# Altium schematic sheet CW340_SAM3X_USB.SchDoc: MCU USB
size Letter; Organization: NewAE Technology Inc.; Address1: 1083 Queen St., Suite 196; Address2: Halifax; Address3: NS; Address4: Canada B3H 0B2; DocumentNumber: .; Revision: .; SheetNumber: 7; SheetTotal: 31; SheetApproved: NO
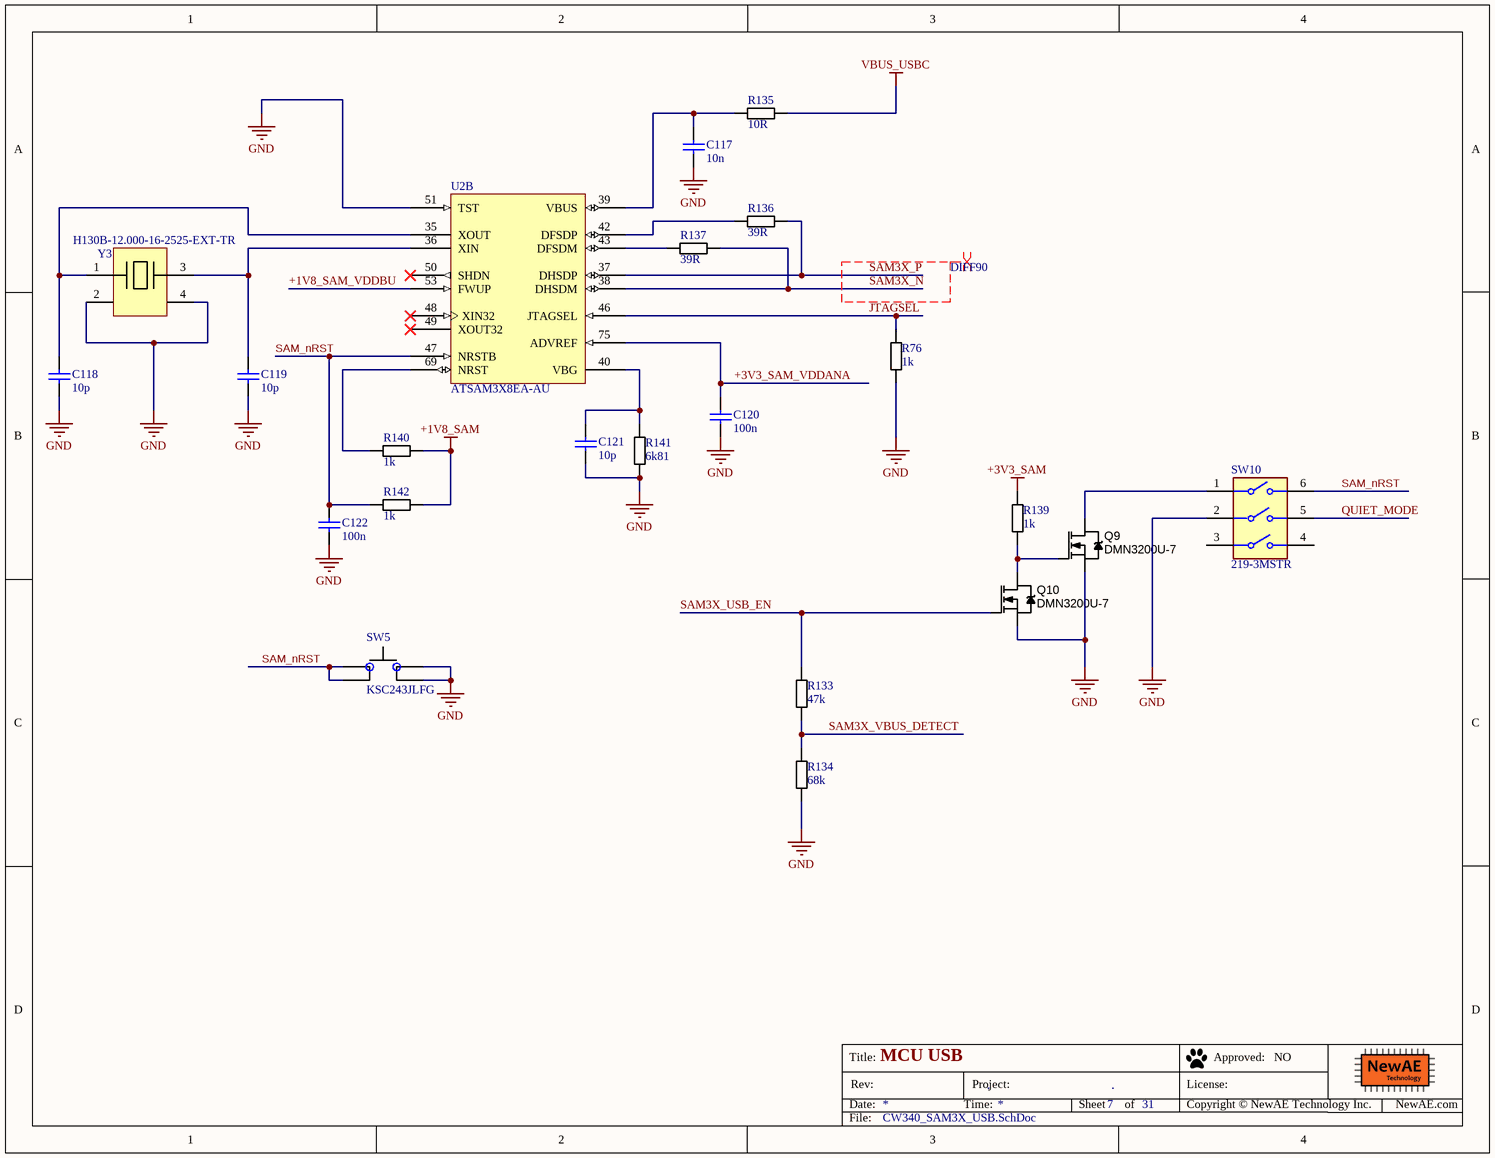
[diagram p0: CW340_SAM3X_USB.SchDoc]

## Parts
C117  10n  [CAPC0603_M]
C118  10p  [RESC1608X55N]
C119  10p  [RESC1608X55N]
C120  100n  [CAPC0402_M]
C121  10p  [CAPC0603_M]
C122  100n  [CAPC0402_M]
Q9  DMN3200U-7  [SOT95P245X110-3M]
Q10  DMN3200U-7  [SOT95P245X110-3M]
R76  1k  [RESC1005X40N]
R133  47k  [RESC1608X55N]
R134  68k  [RESC1608X55N]
R135  10R  [RESC1608X55N]
R136  39R  [RESC1608X55N]
R137  39R  [RESC1608X55N]
R139  1k  [RESC1005X40N]
R140  1k  [RESC1005X40N]
R141  6k81  [RESC1608X55N]
R142  1k  [RESC1005X40N]
SW5  KSC243JLFG  [CK_KSC2J]
SW10  219-3MSTR  [FP-219-3MSTR-MFG]
U2  ATSAM3X8EA-AU  [LQFP144_L]  (part B of 3)
Y3  H130B-12.000-16-2525-EXT-TR  [5x3.2MM XTAL]

## Nets
+1V8_SAM: R140.2 R142.1
+3V3_SAM: R139.2
GND: C117.2 C118.2 C119.2 C120.2 C121.2 C122.2 Q9.2(S) Q10.2(S) R76.2 R134.2 R141.2 SW5.2(IN) SW5.3(IN) SW10.2 U2.51(TST) Y3.2 Y3.4
VBUS_USBC: R135.2
+1V8_SAM_VDDBU: U2.53(FWUP)
+3V3_SAM_VDDANA: C120.1 U2.75(ADVREF)
JTAGSEL: R76.1 U2.46(JTAGSEL)
QUIET_MODE: SW10.5
SAM3X_N: R137.2 U2.38(DHSDM)
SAM3X_P: R136.2 U2.37(DHSDP)
SAM3X_USB_EN: Q10.1(G) R133.1
SAM3X_VBUS_DETECT: R133.2 R134.1
SAM_nRST: C122.1 R142.2 SW5.1(IN) SW5.4(IN) SW10.6 U2.47(NRSTB)
NetC117_1: C117.1 R135.1 U2.39(VBUS)
NetC118_1: C118.1 U2.35(XOUT) Y3.1
NetC119_1: C119.1 U2.36(XIN) Y3.3
NetC121_1: C121.1 R141.1 U2.40(VBG)
NetQ9_1: Q9.1(G) Q10.3(D) R139.1
NetQ9_3: Q9.3(D) SW10.1
NetR136_1: R136.1 U2.42(DFSDP)
NetR137_1: R137.1 U2.43(DFSDM)
NetR140_1: R140.1 U2.69(NRST)

Not connected (* = marked no-connect by the designer): SW10 3 4; U2 48(XIN32)* 49(XOUT32)* 50(SHDN)*

## Layout directives
differential pair; differential pair class DIFF90: SAM3X_N, SAM3X_P

## Notes on the sheet
- Title:
- Date:
- Rev:
- Time:
- Project:
- Sheet
- of
- License:
- Copyright © NewAE Technology Inc.
- Approved:
- NewAE.com
- File:

## Library data of the parts
C117 = CCHIP-10n-0603: 10n, 0603; Component Group: Capacitor; Case-EIA: 0603; Case-Metric: 1608; Part Number: CCHIP-10n-0603; Footprint: 0603; Pin Count: 2; Supplier 1: Digi-Key; Supplier Part Number 1: 399-1091-1-ND; Value: 10n; Mounting Technology: SMT; Component Kind: Standard; Component Type: Standard
C118 C119 = CCHIP-10P-0603-50V: CAP CER 10PF 50V C0G/NP0 0603; Manufacture 1: Murata Electronics North America; Manufacture Part Number 1: GRM1885C1H100JA01D; Component Group: Capacitor; Case-EIA: 0603; Case-Metric: 1608; Tolerance: ±5%; PP Material Stack: 0; Part Number: CCHIP-10P-0603-50V; Footprint: 0603; Pin Count: 2; Supplier 1: Digi-Key; Supplier Part Number 1: 490-1403-1-ND; Value: 10p; Rated Voltage: 50V; Mounting Technology: SMT; Component Kind: Standard; Component Type: Standard; PP Rotation: 0
C120 C122 = CCHIP-100n-0402: 100n, 0402; Manufacture Part Number 1: CGA2B3X7R1V104K050BB; Component Group: Capacitor; Case-EIA: 0402; Part Number: CCHIP-100n-0402; Footprint: 0402; Pin Count: 2; Value: 100n; Mounting Technology: SMT; Component Kind: Standard; Component Type: Standard; Supplier 1: Digi-Key; Supplier Part Number 1: 445-6901-1-ND
C121 = CCHIP-10p-0603: 10p, 0603; Component Group: Capacitor; Case-EIA: 0603; Case-Metric: 1608; Part Number: CCHIP-10p-0603; Footprint: 0603; Pin Count: 2; Supplier 1: Digi-Key; Supplier Part Number 1: 399-1049-1-ND; Value: 10p; Mounting Technology: SMT; Component Kind: Standard; Component Type: Standard
Q9 Q10 = DMN3200U-7: MOSFET N-CH 30V 2.2A SOT23-3; Manufacture 1: Diodes Inc.; Rated Power: 3A; PP Material Stack: 0; Part Number: DMN3200U-7; Component Group: MOSFET; Footprint: SOT23; Manufacture Part Number 1: DMN3200U-7; Pin Count: 3; Supplier 1: Digi-Key; Supplier Part Number 1: DMN3200U-7DICT-ND; Rated Voltage: 30V; Mounting Technology: SMT; RoHS: Yes; Component Kind: Standard; Component Type: Standard; PP Rotation: 0
R76 R139 R140 R142 = RCHIP-1K-0402: 1k res, 0402, 1%, 1/16W; Manufacture 1: Yageo; Manufacture Part Number 1: RC0402FR-071KL; Component Group: Resistor; Case-EIA: 0402; Case-Metric: 1005; Rated Power: 0.063W; Rated Voltage: 75VDC; Part Number: RCHIP-1K-0402; Footprint: 0402; Pin Count: 2; Supplier 1: Digi-Key; Supplier Part Number 1: 311-1.00KLRCT-ND; Value: 1k; Tolerance: 1%; Mounting Technology: SMT; Temperature Range: -55C to 155C; Component Kind: Standard; Component Type: Standard
R133 = RCHIP-47K-0603: 47k res, 0603, 1%, 1/10W; Manufacture 1: Yageo; Manufacture Part Number 1: RC0603FR-0747KL; Component Group: Resistor; Case-EIA: 0603; Case-Metric: 1608; Rated Power: 0.1W; Rated Voltage: 75VDC; Part Number: RCHIP-47K-0603; Footprint: 0603; Pin Count: 2; Supplier 1: Digi-Key; Supplier Part Number 1: 311-47.0KHRCT-ND; Value: 47k; Tolerance: 1%; Mounting Technology: SMT; Temperature Range: -55C to 155C; Component Kind: Standard; Component Type: Standard
R134 = RCHIP-68K-0603: 68k res, 0603, 1%, 1/10W; Manufacture 1: Yageo; Manufacture Part Number 1: RC0603FR-0768KL; Component Group: Resistor; Case-EIA: 0603; Case-Metric: 1608; Rated Power: 0.1W; Rated Voltage: 75VDC; Part Number: RCHIP-68K-0603; Footprint: 0603; Pin Count: 2; Supplier 1: Digi-Key; Supplier Part Number 1: 311-68.0KHRCT-ND; Value: 68k; Tolerance: 1%; Mounting Technology: SMT; Temperature Range: -55C to 155C; Component Kind: Standard; Component Type: Standard
R135 = RCHIP-10R-0603: 10R res, 0603, 1%, 1/10W; Manufacture 1: Yageo; Manufacture Part Number 1: RC0603FR-0710RL; Component Group: Resistor; Case-EIA: 0603; Case-Metric: 1608; Rated Power: 0.1W; Rated Voltage: 75VDC; Part Number: RCHIP-10R-0603; Footprint: 0603; Pin Count: 2; Supplier 1: Digi-Key; Supplier Part Number 1: 311-10.0HRCT-ND; Value: 10R; Tolerance: 1%; Mounting Technology: SMT; Temperature Range: -55C to 155C; Component Kind: Standard; Component Type: Standard
R136 R137 = RCHIP-39R-0603: 39R res, 0603, 1%, 1/10W; Manufacture 1: Yageo; Manufacture Part Number 1: RC0603FR-0739RL; Component Group: Resistor; Case-EIA: 0603; Case-Metric: 1608; Rated Power: 0.1W; Rated Voltage: 75VDC; Part Number: RCHIP-39R-0603; Footprint: 0603; Pin Count: 2; Supplier 1: Digi-Key; Supplier Part Number 1: 311-39.0HRCT-ND; Value: 39R; Tolerance: 1%; Mounting Technology: SMT; Temperature Range: -55C to 155C; Component Kind: Standard; Component Type: Standard
R141 = RCHIP-6K81-0603: 6k81 res, 0603, 1%, 1/10W; Manufacture 1: Yageo; Manufacture Part Number 1: RC0603FR-076K81L; Component Group: Resistor; Case-EIA: 0603; Case-Metric: 1608; Rated Power: 0.1W; Rated Voltage: 75VDC; Part Number: RCHIP-6K81-0603; Footprint: 0603; Pin Count: 2; Supplier 1: Digi-Key; Supplier Part Number 1: 311-6.81KHRCT-ND; Value: 6k81; Tolerance: 1%; Mounting Technology: SMT; Temperature Range: -55C to 155C; Component Kind: Standard; Component Type: Standard
SW5 = TACTSW-KSC243J: SWITCH TACTILE SPST-NO 0.01A 32V; Manufacture 1: C&K; Part Number: TACTSW-KSC243J; Component Group: Switch; Manufacture Part Number 1: KSC243JLFG; Pin Count: 4; Supplier 1: Digi-Key; Supplier Part Number 1: 401-1764-1-ND; Mounting Technology: SMT; RoHS: Yes; Component Kind: Standard; Component Type: Standard
SW10 = CMP-07018-000004-1: SWITCH SLIDE DIP SPST 100MA 20V; Washable: Yes; Mechanical Life: 2000Cycles; Number of Positions: 3; Pitch: 0.1inch; Actuator Type: Slide (Standard); Max Operating Temperature: 85°C; Voltage Rating (DC): 20V; Termination: Gull Wing; Length: 0.358inch; Min Operating Temperature: -55°C; Orientation: Straight; Mount: Surface Mount; Package Quantity: 1000; Current Rating: 100mA; Electrical Life: 2000Cycles; Max Current Rating: 100mA; Throw Configuration: SPST; Contact Material: Copper; Packaging: Tape and Reel; Contact Plating: Gold; Lead Free: Lead Free; Max Voltage Rating (DC): 20V
U2 = CMP-0076-00188-1: SAM3X ARM Cortex-M3 Flash-based Microcontroller, 512 KB Flash, 96 KB SRAM, 103 User I/Os, 1.62 to 3.6 V, -40 to 85 degC, 144-Pin LQFP, RoHS; Manufacturer: Atmel; UART: 5; Max. Operating Freq.: 84 MHz; ADC Resolution: 12 bits; Flash: 512 Kbytes; ADC Channels: 16; SRAM: 96 Kbytes; Max I/O Pins: 103; DAC Channels: 2; SPI: 4; # of Touch Channels: 32; Mounting Technology: Surface Mount; Operating Voltage: 1.62 to 3.6 V; ComponentLink2URL: http://www.atmel.com/Images/doc11057.pdf; CAN: 2; ComponentLink1Description: Manufacturer URL; RoHS: TRUE; PartNumber: ATSAM3X8EA-AU; Temp. Range: -40 to 85 degC; PackageVersion: 11057B; PackageDescription: 100-Pin Quad Flat Package, Body 20 x 20 mm, Pitch 0.5 mm; ComponentLink2Description: Datasheet; DatasheetVersion: 11057B; ComponentLink1URL: http://www.atmel.com/; ComponentLink3Description: Package Specification; ComponentLink3URL: http://www.atmel.com/Images/doc11057.pdf; PackageReference: LQFP-144
Y3 = H130B-12.000-16-2525-EXT-TR: 12MHz ±25ppm Crystal 16pF 35 Ohms 4-SMD, No Lead; Manufacture 1: Raltron Electronics; Value: 12.000MHz; PP Material Stack: 0; Supplier 1: Digi-Key; Stock 1: 4955; Pricing 1: 1=0.590000, 10=0.488000, 50=0.439400, 100=0.390600, 500=0.371100 (USD); Supplier Part Number 1: 2151-H130B-12.000-16-2525-EXT-TR-ND; .Checked SCH: *; .Checked PCB: *; Manufacturer Part Number: H130B-12.000-16-2525-EXT-TR; Part Number: H130B-12.000-16-2525-EXT-TR; Component Group: Crystal; Footprint: 5x3.2mm; Manufacture Part Number 1: H130B-12.000-16-2525-EXT-TR; Pin Count: 4; Mounting Technology: SMT; Component Kind: Standard; Component Type: Standard; PP Rotation: 0